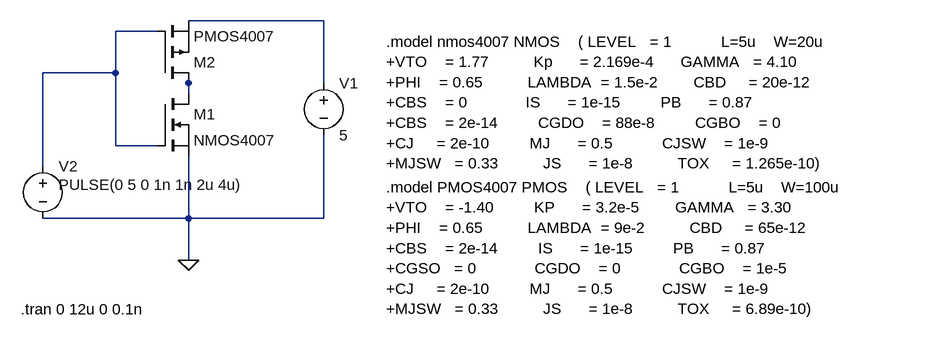
[diagram p0: schematic Practica6.2.asc]
Practica6.2.asc, the LTspice schematic file:
Version 4
SHEET 1 1428 680
WIRE 416 16 208 16
WIRE 160 32 96 32
WIRE 96 96 96 32
WIRE 96 96 -16 96
WIRE 208 112 208 96
WIRE 416 112 416 16
WIRE 208 128 208 112
WIRE 96 208 96 96
WIRE 160 208 96 208
WIRE -16 240 -16 96
WIRE 208 320 208 224
WIRE 208 320 -16 320
WIRE 416 320 416 192
WIRE 416 320 208 320
WIRE 208 384 208 320
FLAG 208 384 0
SYMBOL nmos 160 128 R0
SYMATTR InstName M1
SYMATTR Value NMOS4007
SYMBOL voltage 416 96 R0
WINDOW 123 0 0 Left 0
WINDOW 39 0 0 Left 0
SYMATTR InstName V1
SYMATTR Value 5
SYMBOL voltage -16 224 R0
WINDOW 123 0 0 Left 0
WINDOW 39 0 0 Left 0
WINDOW 3 24 44 Left 2
SYMATTR InstName V2
SYMATTR Value PULSE(0 5 0 1n 1n 2u 4u)
SYMBOL pmos 160 112 M180
SYMATTR InstName M2
SYMATTR Value PMOS4007
TEXT 512 48 Left 2 !.model nmos4007 NMOS    ( LEVEL   = 1           L=5u    W=20u             \n+VTO    = 1.77          Kp      = 2.169e-4      GAMMA   = 4.10  \n+PHI    = 0.65          LAMBDA  = 1.5e-2        CBD     = 20e-12\n+CBS    = 0             IS      = 1e-15         PB      = 0.87\n+CBS    = 2e-14         CGDO    = 88e-8         CGBO    = 0\n+CJ     = 2e-10         MJ      = 0.5           CJSW    = 1e-9\n+MJSW   = 0.33          JS      = 1e-8          TOX     = 1.265e-10)
TEXT 512 272 Left 2 !.model PMOS4007 PMOS    ( LEVEL   = 1           L=5u    W=100u                \n+VTO    = -1.40         KP      = 3.2e-5        GAMMA   = 3.30  \n+PHI    = 0.65          LAMBDA  = 9e-2          CBD     = 65e-12\n+CBS    = 2e-14         IS      = 1e-15         PB      = 0.87\n+CGSO   = 0             CGDO    = 0             CGBO    = 1e-5\n+CJ     = 2e-10         MJ      = 0.5           CJSW    = 1e-9\n+MJSW   = 0.33          JS      = 1e-8          TOX     = 6.89e-10)
TEXT -50 460 Left 2 !.tran 0 12u 0 0.1n

The netlist it stands for:
* Practica6.2.asc
M1 N003 N002 0 0 NMOS4007
V1 N001 0 5
V2 N002 0 PULSE(0 5 0 1n 1n 2u 4u)
M2 N003 N002 N001 N001 PMOS4007
.model NMOS NMOS
.model PMOS PMOS
.lib standard.mos
.model nmos4007 NMOS    ( LEVEL   = 1           L=5u    W=20u
+VTO    = 1.77          Kp      = 2.169e-4      GAMMA   = 4.10
+PHI    = 0.65          LAMBDA  = 1.5e-2        CBD     = 20e-12
+CBS    = 0             IS      = 1e-15         PB      = 0.87
+CBS    = 2e-14         CGDO    = 88e-8         CGBO    = 0
+CJ     = 2e-10         MJ      = 0.5           CJSW    = 1e-9
+MJSW   = 0.33          JS      = 1e-8          TOX     = 1.265e-10)
.model PMOS4007 PMOS    ( LEVEL   = 1           L=5u    W=100u
+VTO    = -1.40         KP      = 3.2e-5        GAMMA   = 3.30
+PHI    = 0.65          LAMBDA  = 9e-2          CBD     = 65e-12
+CBS    = 2e-14         IS      = 1e-15         PB      = 0.87
+CGSO   = 0             CGDO    = 0             CGBO    = 1e-5
+CJ     = 2e-10         MJ      = 0.5           CJSW    = 1e-9
+MJSW   = 0.33          JS      = 1e-8          TOX     = 6.89e-10)
.tran 0 12u 0 0.1n
.backanno
.end